# EAGLE design avr_apple_remote (EAGLE 7.2.0)
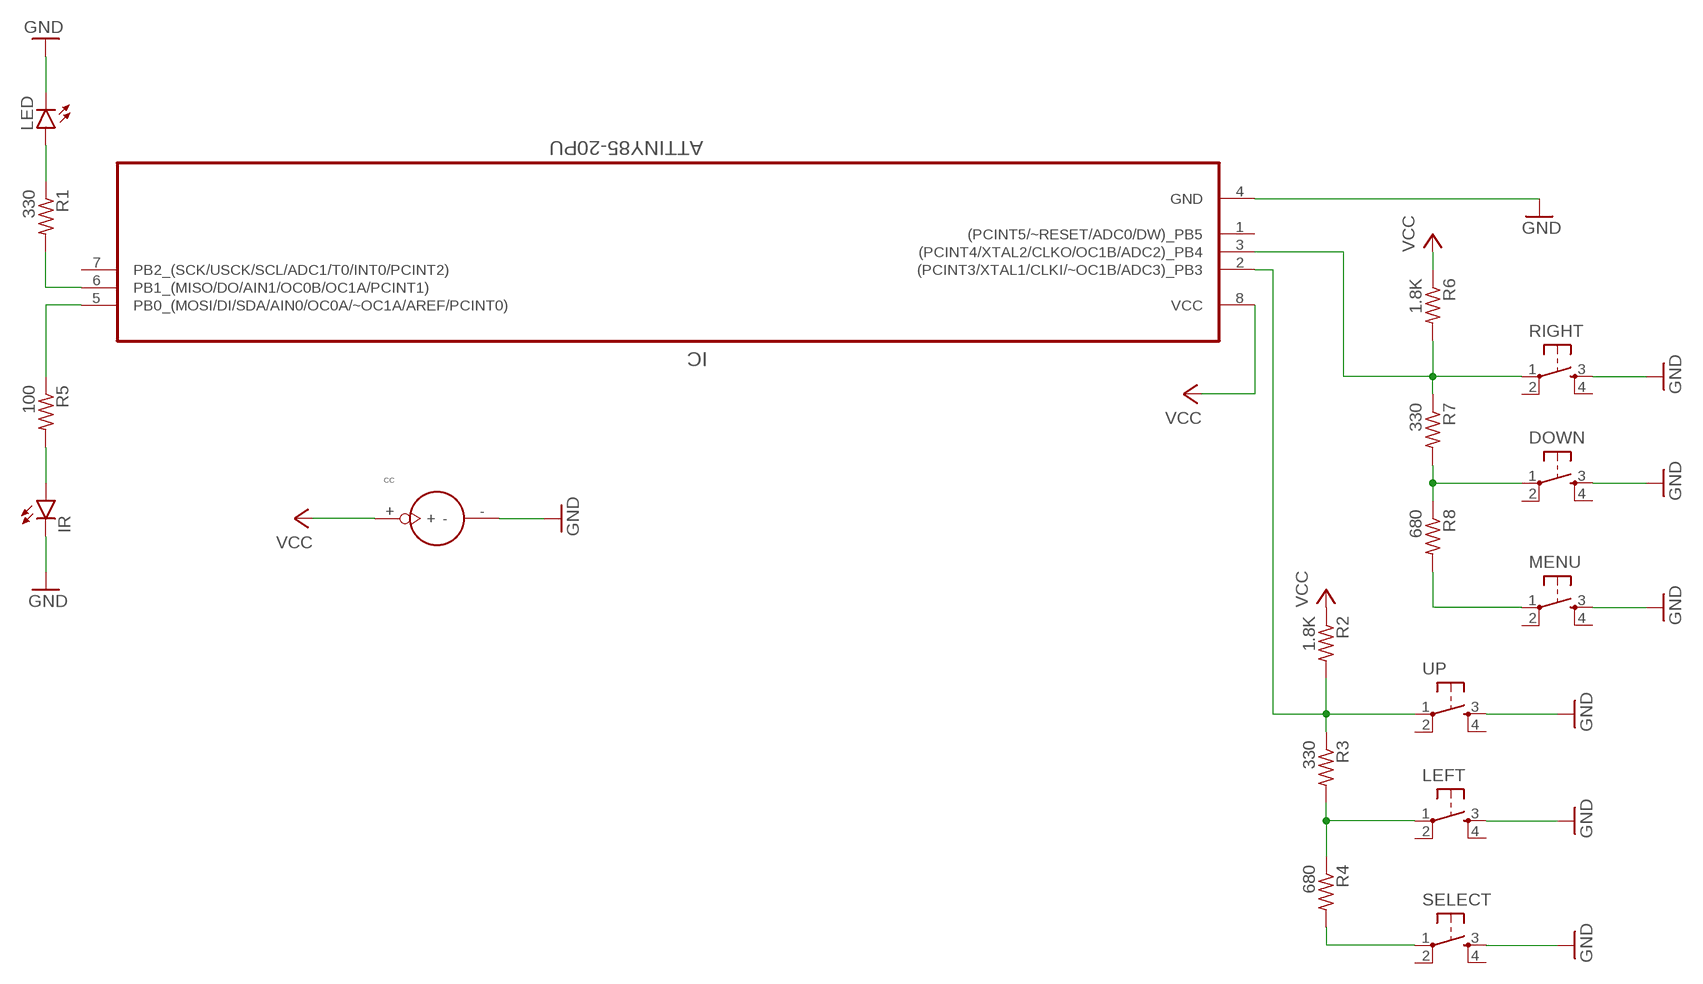
[diagram p0: schematic, sheet 1]

## Parts
CC  BATTERY_1236_C  [BATTERY_1236_C]
DOWN  TACTILE-SWITCH-PTH  [TAC-SWITCH-PTH]
IC  ATTINY85-20PU  [DIP254P762X533-8]
IR  LED5MM  [LED5MM]
LED  LED5MM  [LED5MM]
LEFT  TACTILE-SWITCH-PTH  [TAC-SWITCH-PTH]
MENU  TACTILE-SWITCH-PTH  [TAC-SWITCH-PTH]
R1  330  R-US_0207/10  [0207/10]
R2  1.8K  R-US_0207/10  [0207/10]
R3  330  R-US_0207/10  [0207/10]
R4  680  R-US_0207/10  [0207/10]
R5  100  R-US_0207/10  [0207/10]
R6  1.8K  R-US_0207/10  [0207/10]
R7  330  R-US_0207/10  [0207/10]
R8  680  R-US_0207/10  [0207/10]
RIGHT  TACTILE-SWITCH-PTH  [TAC-SWITCH-PTH]
SELECT  TACTILE-SWITCH-PTH  [TAC-SWITCH-PTH]
UP  TACTILE-SWITCH-PTH  [TAC-SWITCH-PTH]

## Nets
GND: CC.- DOWN.3 IC.4(GND) IR.K(C) LED.K(C) LEFT.3 MENU.3 RIGHT.3 SELECT.3 UP.3
N$1: IC.3((PCINT4/XTAL2/CLKO/OC1B/ADC2)_PB4) R6.2 R7.1 RIGHT.1
N$3: DOWN.1 R7.2 R8.1
N$4: IC.2((PCINT3/XTAL1/CLKI/~OC1B/ADC3)_PB3) R2.2 R3.1 UP.1
N$5: MENU.1 R8.2
N$7: LEFT.1 R3.2 R4.1
N$8: R4.2 SELECT.1
N$9: IC.6(PB1_(MISO/DO/AIN1/OC0B/OC1A/PCINT1)) R1.2
N$10: LED.A R1.1
N$11: IC.5(PB0_(MOSI/DI/SDA/AIN0/OC0A/~OC1A/AREF/PCINT0)) R5.1
N$12: IR.A R5.2
VCC: CC.+ IC.8(VCC) R2.1 R6.1
Unconnected: DOWN.2 DOWN.4 IC.1((PCINT5/~RESET/ADC0/DW)_PB5) IC.7(PB2_(SCK/USCK/SCL/ADC1/T0/INT0/PCINT2)) LEFT.2 LEFT.4 MENU.2 MENU.4 RIGHT.2 RIGHT.4 SELECT.2 SELECT.4 UP.2 UP.4

## Library data of the parts
CC = Itead_BP_110825.lbr:BATTERY_1236_C: SOC004
DOWN LEFT MENU RIGHT SELECT UP = GeekAmmo:TACTILE-SWITCH: Tactile Switch 4 Pins, SPST NO
IC = Atmel_By_element14_Batch_1-00:ATTINY85-20PU: 8-bit Microcontroller with In-System Programmable Flash; MPN: ATTINY85-20PU; OC_FARNELL: 1455162; OC_NEWARK: 58M3796; PACKAGE: PDIP-8; SUPPLIER: Atmel
IR LED = SparkFun-LED:LED: LEDs Standard schematic elements and footprints for 5mm, 3mm, 1206, and 0603 sized LEDs. 5mm - Spark Fun Electronics SKU : COM-00529 (and others)
R1-R8 = rcl:R-US_: RESISTOR, American symbol

## Board
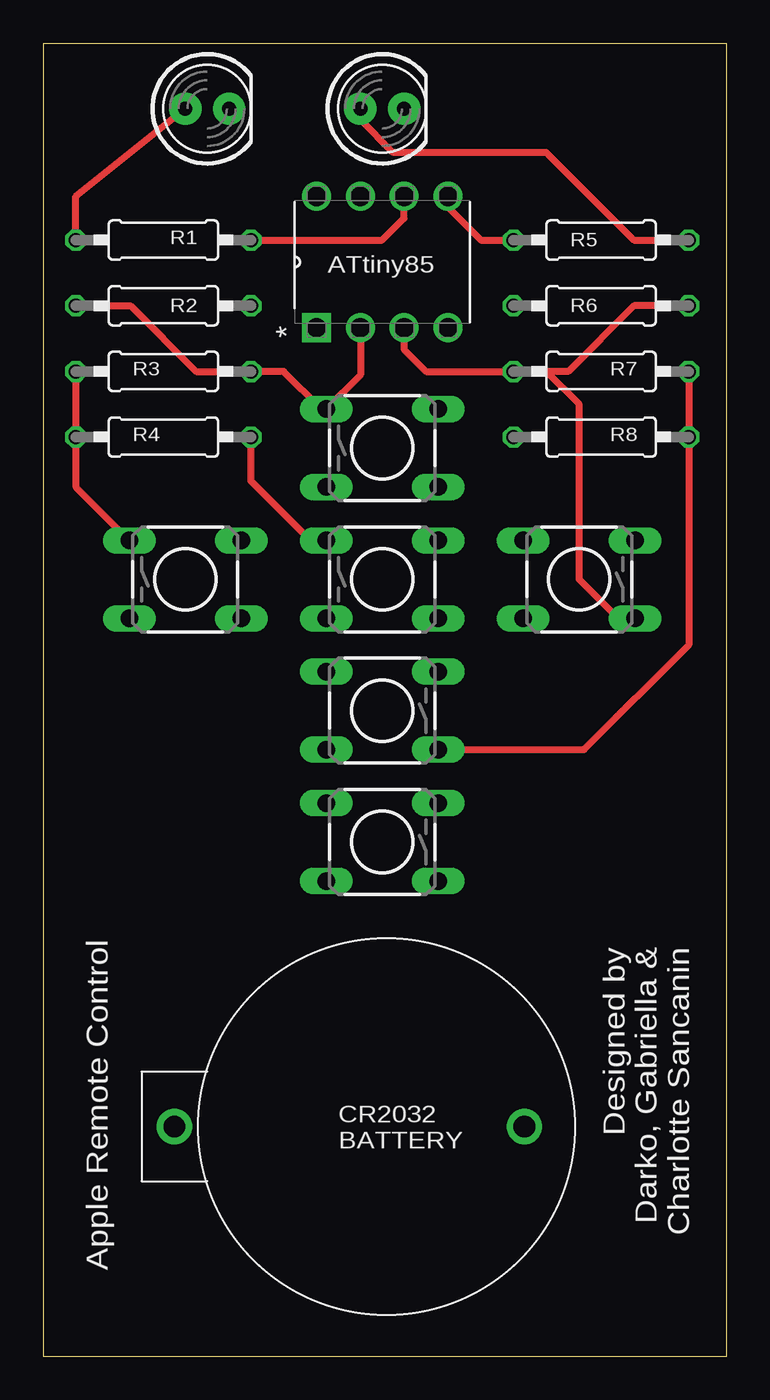
[diagram p1: board, top side]
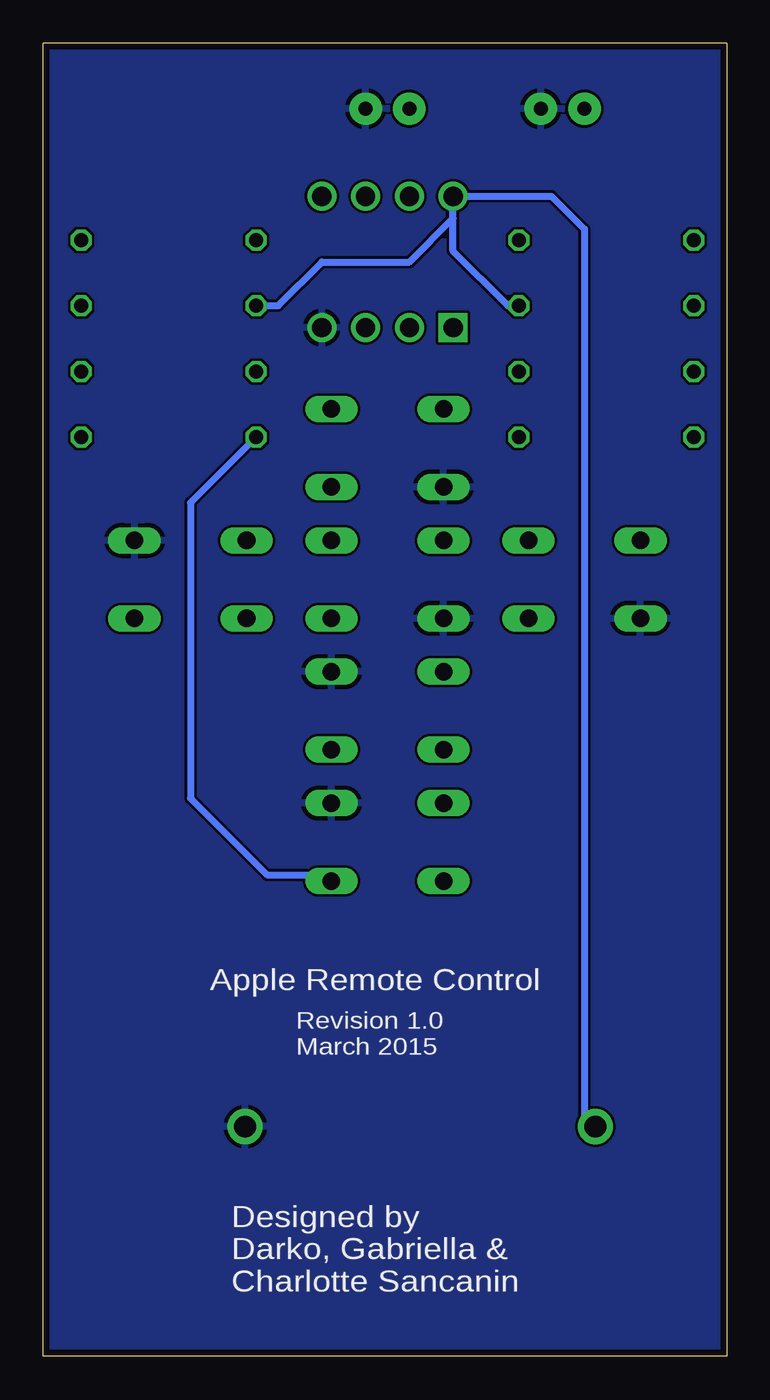
[diagram p2: board, bottom side, seen from below]

Size 39.67 x 76.2 mm. Coordinates in mm from the lower left corner, seen from the top.
Outline: 39.67,76.19 39.67,0 0,0 0,76.19
Outline: 0,76.2 39.67,76.2
Copper layers (1*16): Top 0.0356mm / dielectric 1.5011mm / Bottom 0.0356mm
Design rules "LaenPCBOrder": minimum track width 6mil, minimum drill 13mil, track to track 6mil, track to pad 6mil, pad to pad 6mil, via to via 6mil, smd to smd 6mil, copper to edge 15mil, drill to drill 6mil, minimum pad ring 7mil, minimum via ring 7mil, stop-mask expansion 3mil, vias tented up to drill 0mil, thermal gap 10mil

### Footprints (pad centres in the part's own frame; a part is rotated, then mirrored left to right if it is on the bottom)
BATTERY_1236_C = drill 1.27 pad 2.032: + 0,0; - 0,20.32
TAC-SWITCH-PTH = drill 1.016 pad 1.524 long: 1 -3.251,2.261; 2 3.251,2.261; 3 -3.251,-2.261; 4 3.251,-2.261
DIP254P762X533-8 = drill 1.118 square: 1 -7.62,7.62 | drill 1.118: 2 -7.62,5.08; 3 -7.62,2.54; 4 -7.62,0; 5 0,0; 6 0,2.54; 7 0,5.08; 8 0,7.62
LED5MM = drill 0.813 pad 1.88: A -1.27,0; K 1.27,0
0207/10 = drill 0.813 octagon: 1 -5.08,0; 2 5.08,0

### Placement (x,y rotation side)
CC  7.62,13.34 270 top
DOWN  19.68,37.47 180 top
IC  23.5,67.31 90 top
IR  19.68,72.39 0 top
LED  9.53,72.39 0 top
LEFT  8.26,45.09 0 top
MENU  19.68,29.84 180 top
R1  6.99,64.77 0 top
R2  6.99,60.96 180 top
R3  6.99,57.15 180 top
R4  6.99,53.34 0 top
R5  32.38,64.77 0 top
R6  32.38,60.96 0 top
R7  32.38,57.15 0 top
R8  32.38,53.34 180 top
RIGHT  31.11,45.09 180 top
SELECT  19.68,45.09 0 top
UP  19.68,52.7 0 top

### Tracks (layer width: path | path; a pad name or v marks a point on that pad's centre or on a via)
GND
  pour Bottom: 0,76.2 39.69,76.2 39.69,0 0,0
N$1
  Top 0.406: IC.3 20.95,58.42 22.23,57.15 R7.1 29.21,57.15 | R6.2 34.29,60.96 30.48,57.15 29.21,57.15 | RIGHT.1 33.38,42.82 31.11,45.09 31.11,55.24 29.21,57.15
N$3
  Top 0.406: R7.2 R8.1 37.47,41.27 31.39,35.2 DOWN.1
N$4
  Top 0.406: IC.2 18.41,56.95 UP.1 16.15,54.97 13.97,57.15 R3.1 8.89,57.15 5.08,60.96 R2.2
N$5
  Bottom 0.406: R8.2 31.11,49.53 31.11,32.38 26.67,27.94 23.29,27.94 MENU.1
N$7
  Top 0.406: R3.2 R4.1 1.91,50.44 LEFT.1
N$8
  Top 0.406: SELECT.1 15.52,47.35 12.06,50.8 R4.2
N$9
  Top 0.406: R1.2 19.68,64.77 20.95,66.04 IC.6
N$10
  Top 0.406: R1.1 1.91,67.31 LED.A
N$11
  Top 0.406: IC.5 23.5,66.67 25.4,64.77 R5.1
N$12
  Top 0.406: R5.2 34.29,64.77 29.21,69.85 20.32,69.85 18.41,71.75 IR.A
VCC
  Bottom 0.406: CC.+ 8.26,13.97 8.26,65.41 10.16,67.31 IC.8 15.88,66.04 | R6.1 26.04,60.96 23.5,63.5 18.41,63.5 15.88,66.04 | R2.1 12.7,60.96 15.88,64.14 15.88,66.04

### Text on the board
tPlace: R1 | R5 | ATtiny85 | R2 | R6 | R3 | R7 | R4 | R8 | Designed by / Darko, Gabriella & / Charlotte Sancanin | CR2032 / BATTERY | Apple Remote Control
bPlace: Apple Remote Control | Revision 1.0 / March 2015 | Designed by / Darko, Gabriella & / Charlotte Sancanin